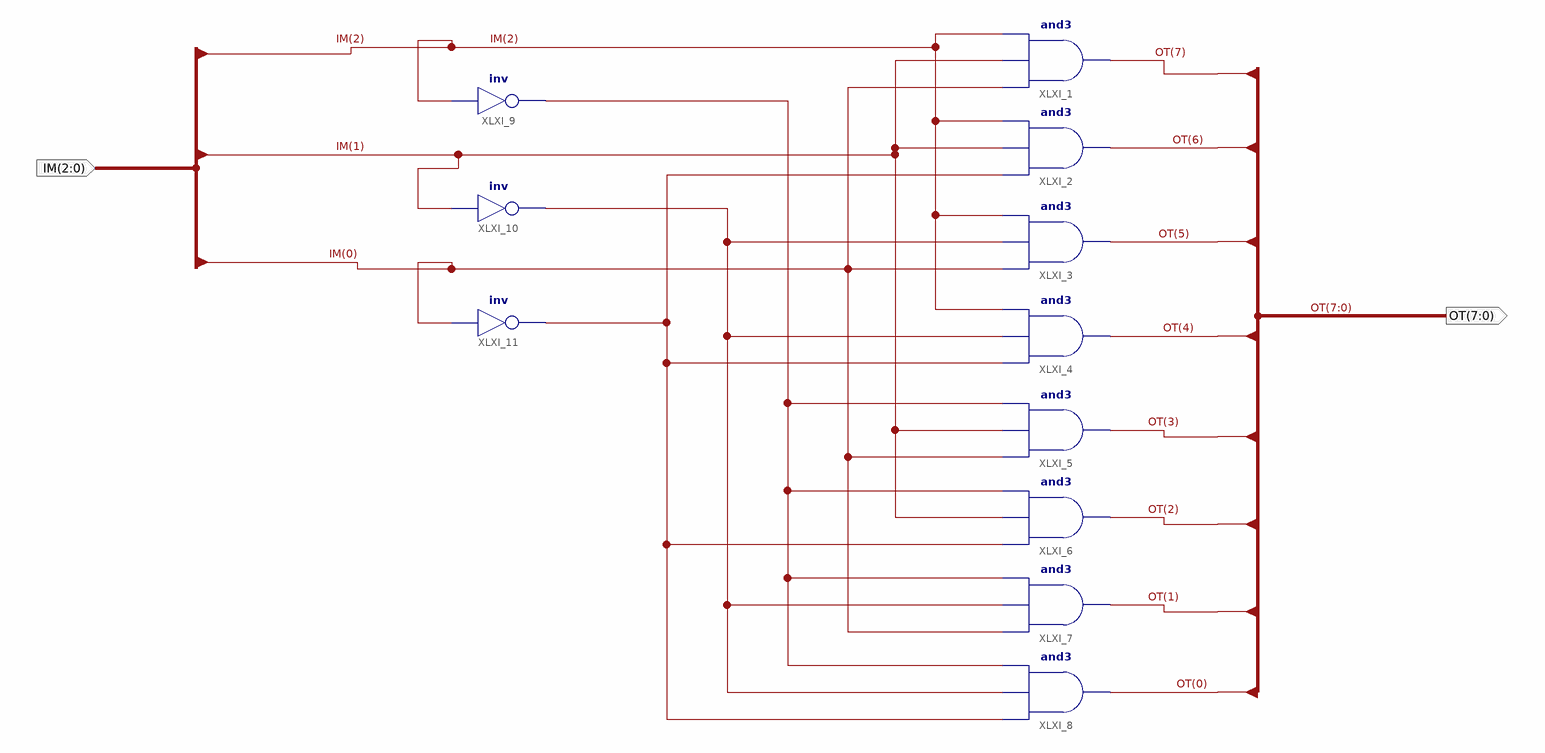
[diagram p0: schematic sheet 1]
// Xilinx ISE schematic MUX3_8.sch (kintex7) as structural Verilog: 11 symbols, 2 ports
module MUX3_8 (
  input  [2:0] IM,
  output [7:0] OT
);

  wire XLXN_16, XLXN_17, XLXN_25;

  not XLXI_9 (XLXN_25, IM[2]);
  not XLXI_10 (XLXN_16, IM[1]);
  not XLXI_11 (XLXN_17, IM[0]);
  and XLXI_1 (OT[7], IM[0], IM[1], IM[2]);
  and XLXI_2 (OT[6], XLXN_17, IM[1], IM[2]);
  and XLXI_3 (OT[5], IM[0], XLXN_16, IM[2]);
  and XLXI_4 (OT[4], XLXN_17, XLXN_16, IM[2]);
  and XLXI_5 (OT[3], IM[0], IM[1], XLXN_25);
  and XLXI_6 (OT[2], XLXN_17, IM[1], XLXN_25);
  and XLXI_7 (OT[1], IM[0], XLXN_16, XLXN_25);
  and XLXI_8 (OT[0], XLXN_17, XLXN_16, XLXN_25);
endmodule
